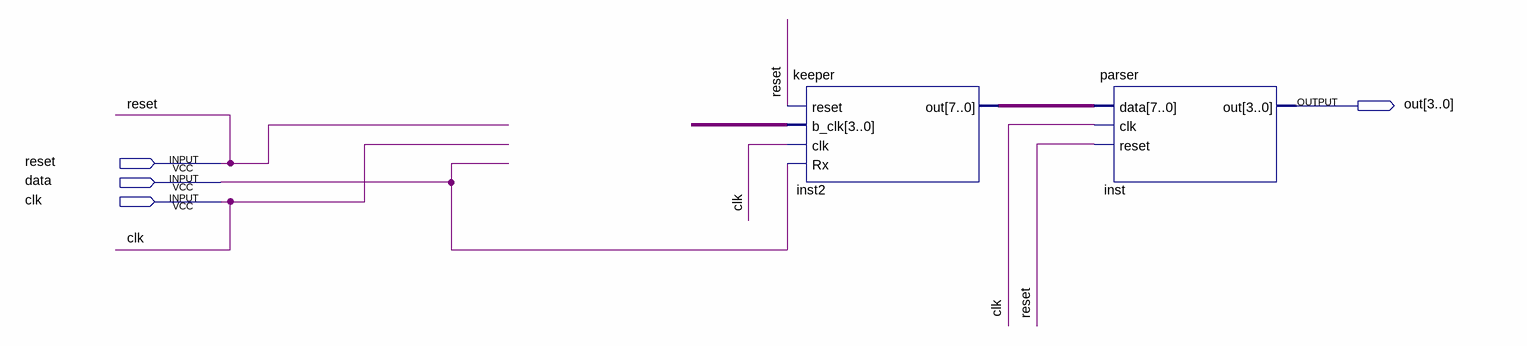
[diagram p0: schematic sheet]
// Quartus schematic block.bdf as structural Verilog: 2 symbols, 4 pins
module block (
  input  reset,
  input  data,
  input  clk,
  output [3:0] out
);

  wire [3:0] undriven;
  wire [7:0] inst2_out;

  keeper inst2 (.reset(reset), .b_clk(undriven), .clk(clk), .Rx(data), .out(inst2_out));
  parser inst (.data(inst2_out), .clk(clk), .reset(reset), .out(out));
endmodule
